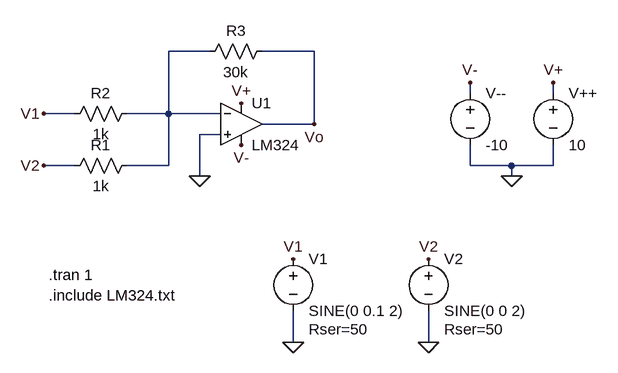
[diagram p0: schematic Lab2Circ1.asc]
Lab2Circ1.asc, the LTspice schematic file:
Version 4
SHEET 1 1424 680
WIRE 160 48 96 48
WIRE 320 48 240 48
WIRE 560 112 560 96
WIRE 688 112 688 96
WIRE -48 144 -96 144
WIRE 96 144 96 48
WIRE 96 144 32 144
WIRE 176 144 96 144
WIRE 320 160 320 48
WIRE 320 160 240 160
WIRE 176 176 144 176
WIRE -48 224 -96 224
WIRE 96 224 96 144
WIRE 96 224 32 224
WIRE 560 224 560 192
WIRE 624 224 560 224
WIRE 688 224 688 192
WIRE 688 224 624 224
WIRE 144 240 144 176
WIRE 624 240 624 224
WIRE 288 496 288 448
WIRE 496 496 496 448
FLAG 624 240 0
FLAG 688 96 V+
FLAG 208 128 V+
FLAG 560 96 V-
FLAG 208 192 V-
FLAG 288 496 0
FLAG 496 496 0
FLAG 288 368 V1
FLAG 496 368 V2
FLAG 320 160 Vo
FLAG -96 144 V1
FLAG -96 224 V2
FLAG 144 240 0
SYMBOL AutoGenerated\\LM324 208 96 R0
SYMATTR InstName U1
SYMBOL voltage 688 96 R0
WINDOW 123 0 0 Left 0
WINDOW 39 24 124 Left 2
SYMATTR InstName V++
SYMATTR Value 10
SYMBOL voltage 560 96 R0
WINDOW 123 0 0 Left 0
WINDOW 39 24 124 Left 2
SYMATTR InstName V--
SYMATTR Value -10
SYMBOL res 48 128 R90
WINDOW 0 0 56 VBottom 2
WINDOW 3 32 56 VTop 2
SYMATTR InstName R2
SYMATTR Value 1k
SYMBOL res 256 32 R90
WINDOW 0 0 56 VBottom 2
WINDOW 3 32 56 VTop 2
SYMATTR InstName R3
SYMATTR Value 30k
SYMBOL voltage 288 352 R0
WINDOW 123 24 124 Left 2
WINDOW 39 24 124 Left 2
SYMATTR SpiceLine Rser=50
SYMATTR InstName V1
SYMATTR Value SINE(0 0.1 2)
SYMBOL voltage 496 352 R0
WINDOW 123 24 124 Left 2
WINDOW 39 24 124 Left 2
SYMATTR SpiceLine Rser=50
SYMATTR InstName V2
SYMATTR Value SINE(0 0 2)
SYMBOL res 48 208 R90
WINDOW 0 0 56 VBottom 2
WINDOW 3 32 56 VTop 2
SYMATTR InstName R1
SYMATTR Value 1k
TEXT -88 424 Left 2 !.include LM324.txt
TEXT -88 392 Left 2 !.tran 1

The netlist it stands for:
* Lab2Circ1.asc
* U1: LM324 (symbol AutoGenerated\LM324 not available, pins judged from their places): In+=0 In-=N001 V+=V+ V-=V- OUT=Vo
V++ V+ 0 10
V-- V- 0 -10
R2 N001 V1 1k
R3 Vo N001 30k
V1 V1 0 SINE(0 0.1 2) Rser=50
V2 V2 0 SINE(0 0 2) Rser=50
R1 N001 V2 1k
.include LM324.txt
.tran 1
.backanno
.end